# Altium schematic sheet Coolant_System.SchDoc: <Document>
size Letter; Engineer: <Engineer>; Organization: UPEL; Address1: USU Power Electronics Lab; Address2: USTAR Building 620, RM 118; Address3: 1600 N 620 E; Address4: North Logan, UT 84341; DocumentNumber: 15; Revision: v1; SheetNumber: 15; SheetTotal: 16; ProjectName: <Project>
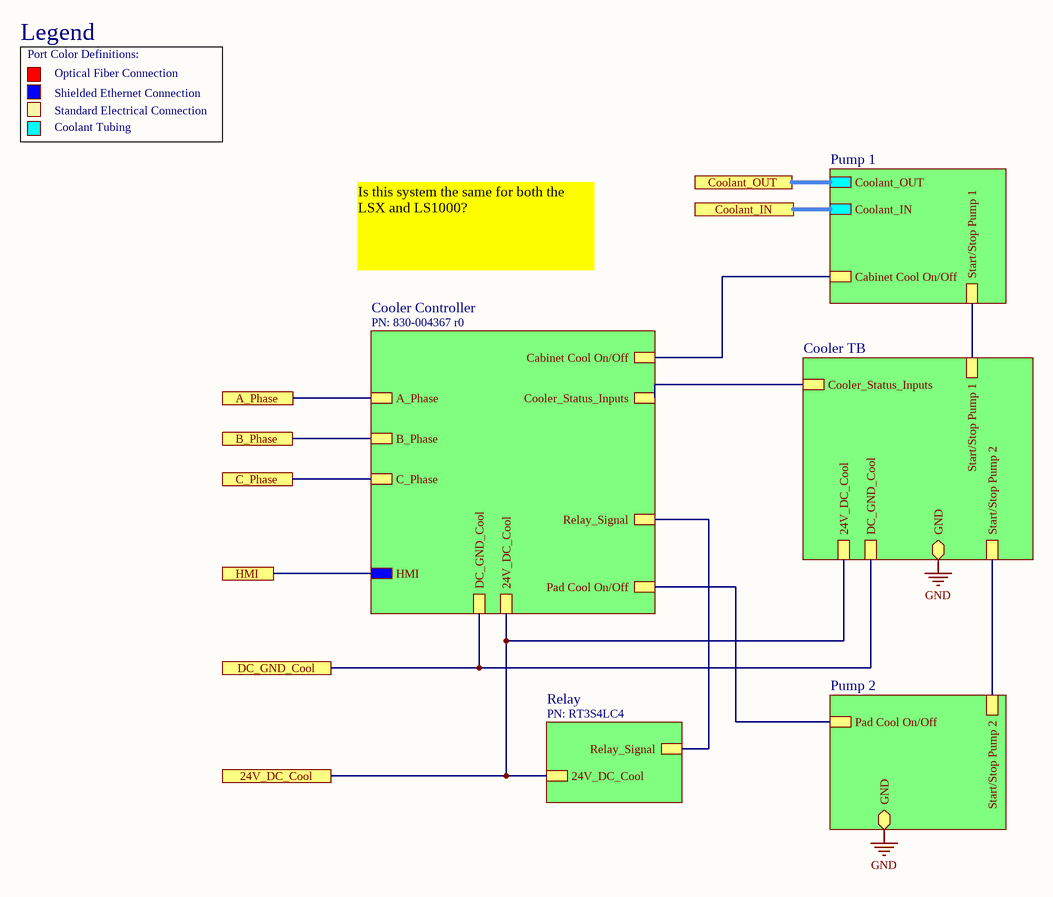
[diagram p0: Coolant_System.SchDoc]

## Sub-sheets
Designator = Cooler Controller: DC_GND_Cool, 24V_DC_Cool, HMI, A_Phase, B_Phase, C_Phase, Relay_Signal, Cooler_Status_Inputs, Pad Cool On/Off, Cabinet Cool On/Off
Designator = Pump 1: Cabinet Cool On/Off, Coolant_OUT, Coolant_IN, Start/Stop Pump 1
Designator = Pump 2: Pad Cool On/Off, Start/Stop Pump 2, GND (bidir)
Designator = Cooler TB: Cooler_Status_Inputs, 24V_DC_Cool, DC_GND_Cool, GND (bidir), Start/Stop Pump 1, Start/Stop Pump 2
Relay = Relay: 24V_DC_Cool, Relay_Signal

## Ports
24V_DC_Cool, A_Phase, B_Phase, C_Phase, Coolant_IN, Coolant_OUT, DC_GND_Cool, HMI

## Nets
GND: sheet Designator/GND, sheet Designator/GND
24V_DC_Cool: port 24V_DC_Cool, sheet Relay/24V_DC_Cool, sheet Designator/24V_DC_Cool, sheet Designator/24V_DC_Cool
A_Phase: port A_Phase, sheet Designator/A_Phase
B_Phase: port B_Phase, sheet Designator/B_Phase
C_Phase: port C_Phase, sheet Designator/C_Phase
Coolant_IN: port Coolant_IN, sheet Designator/Coolant_IN
Coolant_OUT: port Coolant_OUT, sheet Designator/Coolant_OUT
DC_GND_Cool: port DC_GND_Cool, sheet Designator/DC_GND_Cool, sheet Designator/DC_GND_Cool
HMI: port HMI, sheet Designator/HMI
(unnamed): sheet Relay/Relay_Signal, sheet Designator/Relay_Signal
(unnamed): sheet Designator/Cooler_Status_Inputs, sheet Designator/Cooler_Status_Inputs
(unnamed): sheet Designator/Pad Cool On/Off, sheet Designator/Pad Cool On/Off
(unnamed): sheet Designator/Cabinet Cool On/Off, sheet Designator/Cabinet Cool On/Off
(unnamed): sheet Designator/Start/Stop Pump 1, sheet Designator/Start/Stop Pump 1
(unnamed): sheet Designator/Start/Stop Pump 2, sheet Designator/Start/Stop Pump 2

## Notes on the sheet
- Legend
- Port Color Definitions:
- Optical Fiber Connection
- Shielded Ethernet Connection
- Standard Electrical Connection
- Coolant Tubing
- Is this system the same for both the LSX and LS1000?
- PN: 830-004367 r0
- PN: RT3S4LC4
- Project:
- Engineer:
- Document:
- Approved By:
- Date:
- Revision:
- File:
- Sheet
- of